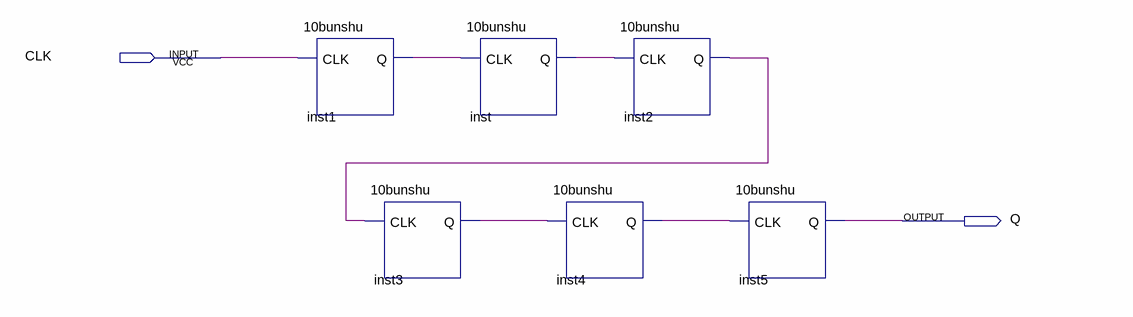
[diagram p0: schematic sheet]
// Quartus schematic bun60hz.bdf as structural Verilog: 6 symbols, 2 pins
module bun60hz (
  input  CLK,
  output Q
);

  wire inst1_q, inst2_q, inst3_q, inst4_q, inst_q;

  \10bunshu  inst1 (.CLK(CLK), .Q(inst1_q));
  \10bunshu  inst3 (.CLK(inst2_q), .Q(inst3_q));
  \10bunshu  inst (.CLK(inst1_q), .Q(inst_q));
  \10bunshu  inst4 (.CLK(inst3_q), .Q(inst4_q));
  \10bunshu  inst2 (.CLK(inst_q), .Q(inst2_q));
  \10bunshu  inst5 (.CLK(inst4_q), .Q(Q));
endmodule
